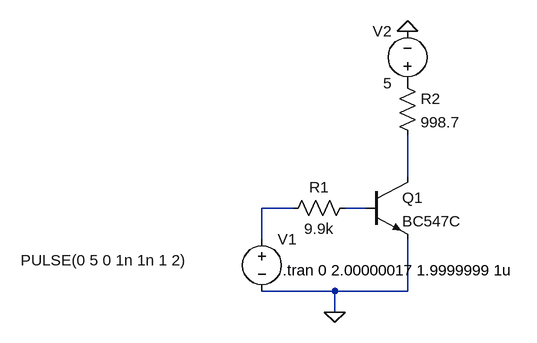
[diagram p0: schematic Draft1.asc]
Draft1.asc, the LTspice schematic file:
Version 4.1
SHEET 1 1344 680
WIRE 304 128 304 64
WIRE 128 176 80 176
WIRE 240 176 208 176
WIRE 80 224 80 176
WIRE 192 304 80 304
WIRE 304 304 304 224
WIRE 304 304 192 304
WIRE 192 336 192 304
FLAG 192 336 0
FLAG 304 -96 0
SYMBOL voltage 80 208 R0
WINDOW 3 -371 48 Left 2
WINDOW 123 0 0 Left 0
WINDOW 39 0 0 Left 0
SYMATTR Value PULSE(0 5 0 1n 1n 1 2)
SYMATTR InstName V1
SYMBOL voltage 304 0 R180
WINDOW 0 24 96 Left 2
WINDOW 3 24 16 Left 2
WINDOW 123 0 0 Left 0
WINDOW 39 0 0 Left 0
SYMATTR InstName V2
SYMATTR Value 5
SYMBOL res 224 160 R90
WINDOW 0 0 56 VBottom 2
WINDOW 3 32 56 VTop 2
SYMATTR InstName R1
SYMATTR Value 9.9k
SYMBOL res 288 -32 R0
SYMATTR InstName R2
SYMATTR Value 998.7
SYMBOL npn2 240 128 R0
SYMATTR InstName Q1
SYMATTR Value BC547C
TEXT 112 272 Left 2 !.tran 0 2.00000017 1.9999999 1u

The netlist it stands for:
* Draft1.asc
V1 N002 0 PULSE(0 5 0 1n 1n 1 2)
V2 P001 0 5
R1 N003 N002 9.9k
R2 P001 N001 998.7
Q1 N001 N003 0 0 BC547C
.model NPN NPN
.model PNP PNP
.lib standard.bjt
.tran 0 2.00000017 1.9999999 1u
.backanno
.end